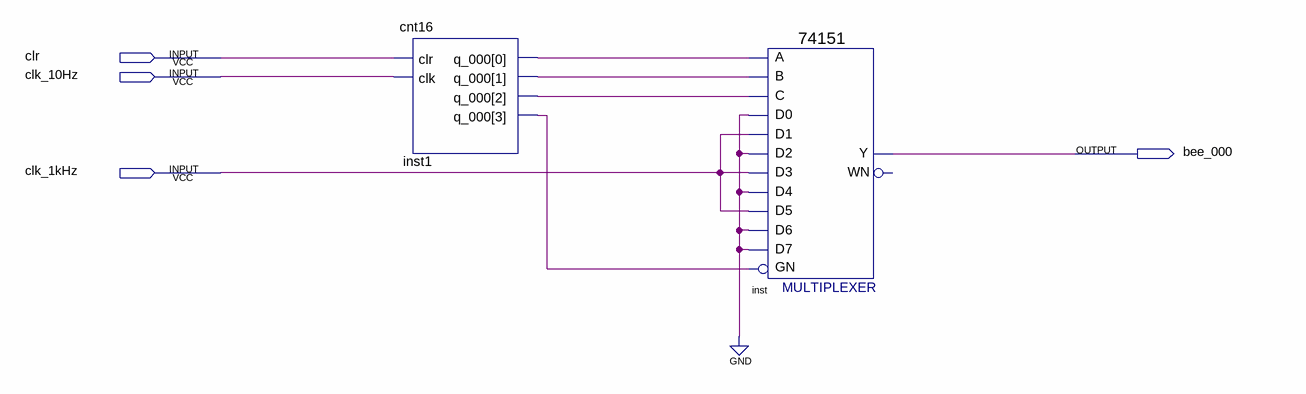
[diagram p0: schematic sheet]
// Quartus schematic knocker.bdf as structural Verilog: 2 symbols, 4 pins
module knocker (
  input  clr,
  input  clk_10Hz,
  input  clk_1kHz,
  output bee_000
);

  wire inst1_q_000, inst1_q_000_2, inst1_q_000_3, inst1_q_000_4;

  cnt16 inst1 (.clr(clr), .clk(clk_10Hz), .q_000({inst1_q_000, inst1_q_000_4, inst1_q_000_3, inst1_q_000_2}));
  \74151  inst (
    .GN(inst1_q_000), .C(inst1_q_000_4), .B(inst1_q_000_3), .A(inst1_q_000_2), .D5(clk_1kHz), .D0(1'b0),
    .D1(clk_1kHz), .D4(1'b0), .D3(clk_1kHz), .D2(1'b0), .D6(1'b0), .D7(1'b0), .Y(bee_000));  // open: WN
endmodule
